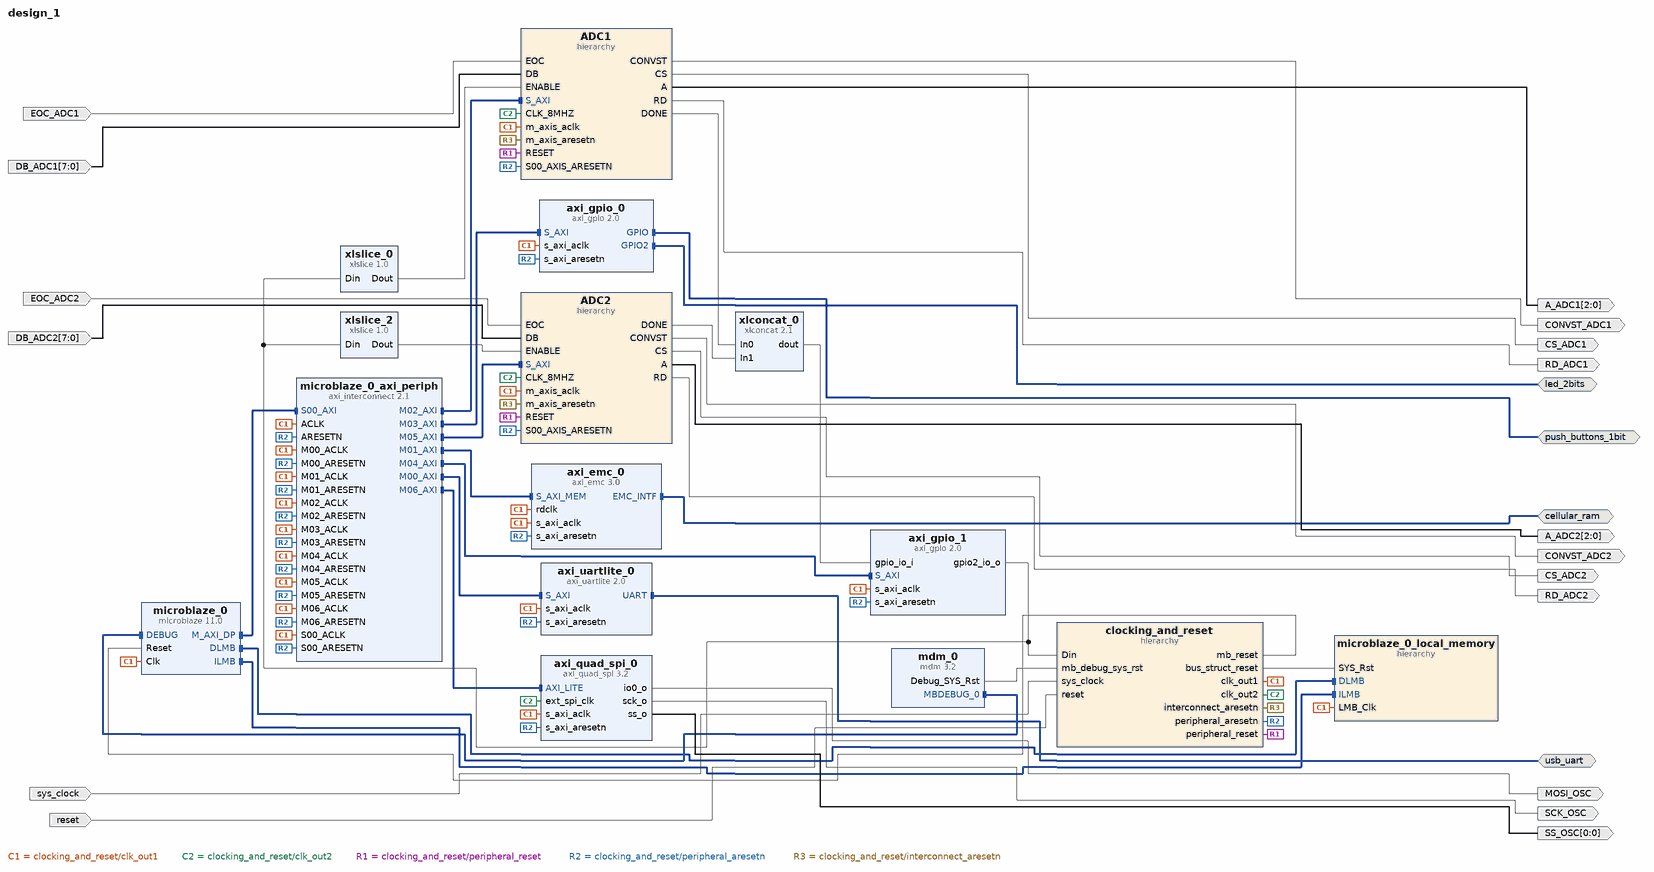
[diagram p0: block diagram of the top level]
# Vivado block design design_1, xc7a35tcpg236-1, Vivado 2018.3
create_bd_design design_1

create_bd_intf_port -mode Master -vlnv xilinx.com:interface:uart_rtl:1.0 usb_uart
create_bd_intf_port -mode Master -vlnv xilinx.com:interface:emc_rtl:1.0 cellular_ram
create_bd_intf_port -mode Master -vlnv xilinx.com:interface:gpio_rtl:1.0 led_2bits
create_bd_intf_port -mode Master -vlnv xilinx.com:interface:gpio_rtl:1.0 push_buttons_1bit
create_bd_port -dir I -type rst reset
set_property -dict {CONFIG.POLARITY ACTIVE_HIGH} [get_bd_ports reset]
create_bd_port -dir I -type clk sys_clock
set_property -dict {CONFIG.FREQ_HZ 12000000 CONFIG.PHASE 0.000} [get_bd_ports sys_clock]
create_bd_port -dir O RD_ADC1
create_bd_port -dir O CS_ADC1
create_bd_port -dir I EOC_ADC1
create_bd_port -dir I -from 7 -to 0 DB_ADC1
create_bd_port -dir O CONVST_ADC1
create_bd_port -dir O -from 2 -to 0 A_ADC1
create_bd_port -dir O CONVST_ADC2
create_bd_port -dir O CS_ADC2
create_bd_port -dir O -from 2 -to 0 A_ADC2
create_bd_port -dir O RD_ADC2
create_bd_port -dir I -from 7 -to 0 DB_ADC2
create_bd_port -dir I EOC_ADC2
create_bd_port -dir O MOSI_OSC
create_bd_port -dir O -from 0 -to 0 SS_OSC
create_bd_port -dir O SCK_OSC

create_bd_cell -type ip -vlnv xilinx.com:ip:mdm:3.2 mdm_0
create_bd_cell -type ip -vlnv xilinx.com:ip:microblaze:11.0 microblaze_0
set_property -dict {CONFIG.C_DEBUG_ENABLED 1 CONFIG.C_D_AXI 1 CONFIG.C_D_LMB 1 CONFIG.C_I_LMB 1} [get_bd_cells microblaze_0]
create_bd_cell -type hier microblaze_0_local_memory
create_bd_cell -type ip -vlnv xilinx.com:ip:axi_uartlite:2.0 axi_uartlite_0
set_property -dict [list \
  CONFIG.C_BAUDRATE 115200 \
  CONFIG.UARTLITE_BOARD_INTERFACE usb_uart \
  CONFIG.USE_BOARD_FLOW true \
] [get_bd_cells axi_uartlite_0]
create_bd_cell -type ip -vlnv xilinx.com:ip:axi_interconnect:2.1 microblaze_0_axi_periph
set_property -dict {CONFIG.NUM_MI 7} [get_bd_cells microblaze_0_axi_periph]
create_bd_cell -type ip -vlnv xilinx.com:ip:axi_emc:3.0 axi_emc_0
set_property -dict {CONFIG.EMC_BOARD_INTERFACE cellular_ram CONFIG.USE_BOARD_FLOW true} [get_bd_cells axi_emc_0]
create_bd_cell -type ip -vlnv xilinx.com:ip:axi_gpio:2.0 axi_gpio_0
set_property -dict [list \
  CONFIG.GPIO2_BOARD_INTERFACE led_2bits \
  CONFIG.GPIO_BOARD_INTERFACE push_buttons_1bit \
  CONFIG.USE_BOARD_FLOW true \
] [get_bd_cells axi_gpio_0]
create_bd_cell -type ip -vlnv xilinx.com:ip:axi_gpio:2.0 axi_gpio_1
set_property -dict [list \
  CONFIG.C_ALL_INPUTS 1 \
  CONFIG.C_ALL_OUTPUTS_2 1 \
  CONFIG.C_GPIO2_WIDTH 3 \
  CONFIG.C_GPIO_WIDTH 2 \
  CONFIG.C_IS_DUAL 1 \
  CONFIG.GPIO_BOARD_INTERFACE Custom \
  CONFIG.USE_BOARD_FLOW true \
] [get_bd_cells axi_gpio_1]
create_bd_cell -type ip -vlnv xilinx.com:ip:xlslice:1.0 xlslice_0
set_property -dict {CONFIG.DIN_FROM 1 CONFIG.DIN_TO 1 CONFIG.DIN_WIDTH 3 CONFIG.DOUT_WIDTH 1} [get_bd_cells xlslice_0]
create_bd_cell -type hier ADC1
create_bd_cell -type hier ADC2
create_bd_cell -type ip -vlnv xilinx.com:ip:xlslice:1.0 xlslice_2
set_property -dict {CONFIG.DIN_FROM 2 CONFIG.DIN_TO 2 CONFIG.DIN_WIDTH 3 CONFIG.DOUT_WIDTH 1} [get_bd_cells xlslice_2]
create_bd_cell -type ip -vlnv xilinx.com:ip:xlconcat:2.1 xlconcat_0
create_bd_cell -type hier clocking_and_reset
create_bd_cell -type ip -vlnv xilinx.com:ip:axi_quad_spi:3.2 axi_quad_spi_0
set_property -dict [list \
  CONFIG.C_FIFO_DEPTH 0 \
  CONFIG.C_NUM_TRANSFER_BITS 32 \
  CONFIG.C_SCK_RATIO 16 \
  CONFIG.C_USE_STARTUP 0 \
  CONFIG.FIFO_INCLUDED 0 \
  CONFIG.Master_mode 1 \
] [get_bd_cells axi_quad_spi_0]

# ---- hierarchy /microblaze_0_local_memory ----
current_bd_instance /microblaze_0_local_memory
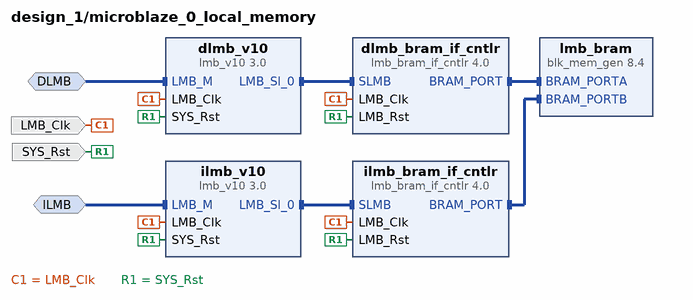
[diagram p1: block diagram inside /microblaze_0_local_memory]
create_bd_intf_pin -mode MirroredMaster -vlnv xilinx.com:interface:lmb_rtl:1.0 DLMB
create_bd_intf_pin -mode MirroredMaster -vlnv xilinx.com:interface:lmb_rtl:1.0 ILMB
create_bd_pin -dir I -type clk LMB_Clk
create_bd_pin -dir I -type rst SYS_Rst

create_bd_cell -type ip -vlnv xilinx.com:ip:lmb_v10:3.0 dlmb_v10
create_bd_cell -type ip -vlnv xilinx.com:ip:lmb_v10:3.0 ilmb_v10
create_bd_cell -type ip -vlnv xilinx.com:ip:lmb_bram_if_cntlr:4.0 dlmb_bram_if_cntlr
set_property -dict {CONFIG.C_ECC 0} [get_bd_cells dlmb_bram_if_cntlr]
create_bd_cell -type ip -vlnv xilinx.com:ip:lmb_bram_if_cntlr:4.0 ilmb_bram_if_cntlr
set_property -dict {CONFIG.C_ECC 0} [get_bd_cells ilmb_bram_if_cntlr]
create_bd_cell -type ip -vlnv xilinx.com:ip:blk_mem_gen:8.4 lmb_bram
set_property -dict {CONFIG.Memory_Type True_Dual_Port_RAM CONFIG.use_bram_block BRAM_Controller} [get_bd_cells lmb_bram]

# ---- hierarchy /ADC1 ----
current_bd_instance /ADC1
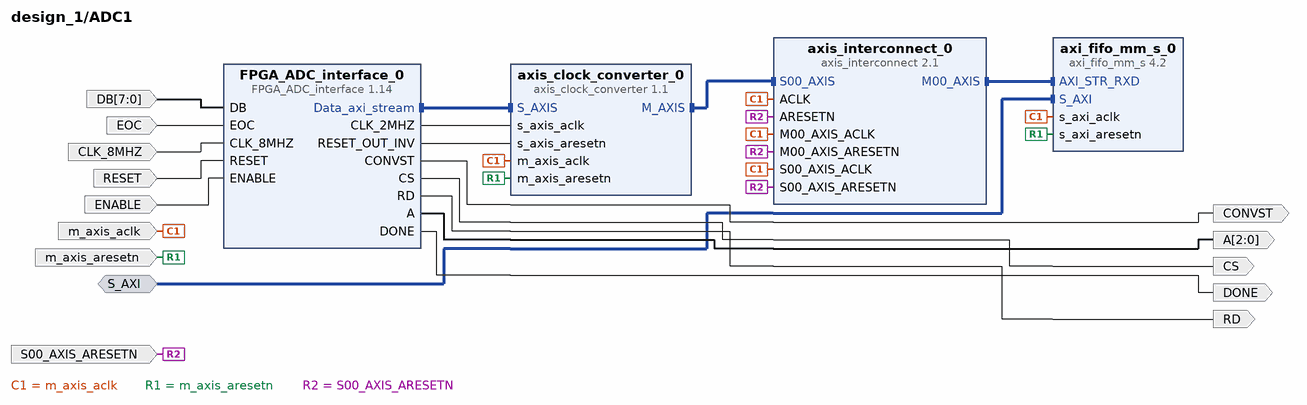
[diagram p2: block diagram inside /ADC1]
create_bd_intf_pin -mode Slave -vlnv xilinx.com:interface:aximm_rtl:1.0 S_AXI
create_bd_pin -dir O CONVST
create_bd_pin -dir I -from 7 -to 0 DB
create_bd_pin -dir I EOC
create_bd_pin -dir O CS
create_bd_pin -dir O RD
create_bd_pin -dir O -from 2 -to 0 A
create_bd_pin -dir O DONE
create_bd_pin -dir I -type clk CLK_8MHZ
create_bd_pin -dir I -type rst RESET
create_bd_pin -dir I ENABLE
create_bd_pin -dir I -type clk m_axis_aclk
create_bd_pin -dir I -type rst m_axis_aresetn
create_bd_pin -dir I -type rst S00_AXIS_ARESETN

create_bd_cell -type ip -vlnv Carslake.me:user:FPGA_ADC_interface:1.14 FPGA_ADC_interface_0
set_property -dict {CONFIG.MAXSAMPLES 32000} [get_bd_cells FPGA_ADC_interface_0]
create_bd_cell -type ip -vlnv xilinx.com:ip:axi_fifo_mm_s:4.2 axi_fifo_mm_s_0
set_property -dict [list \
  CONFIG.C_DATA_INTERFACE_TYPE 0 \
  CONFIG.C_RX_FIFO_DEPTH 8192 \
  CONFIG.C_RX_FIFO_PE_THRESHOLD 5 \
  CONFIG.C_RX_FIFO_PF_THRESHOLD 8100 \
  CONFIG.C_USE_TX_CTRL 0 \
  CONFIG.C_USE_TX_DATA 0 \
] [get_bd_cells axi_fifo_mm_s_0]
create_bd_cell -type ip -vlnv xilinx.com:ip:axis_clock_converter:1.1 axis_clock_converter_0
set_property -dict {CONFIG.SYNCHRONIZATION_STAGES 5} [get_bd_cells axis_clock_converter_0]
create_bd_cell -type ip -vlnv xilinx.com:ip:axis_interconnect:2.1 axis_interconnect_0
set_property -dict {CONFIG.ENABLE_ADVANCED_OPTIONS 1 CONFIG.NUM_MI 1} [get_bd_cells axis_interconnect_0]

# ---- hierarchy /ADC2 ----
current_bd_instance /ADC2
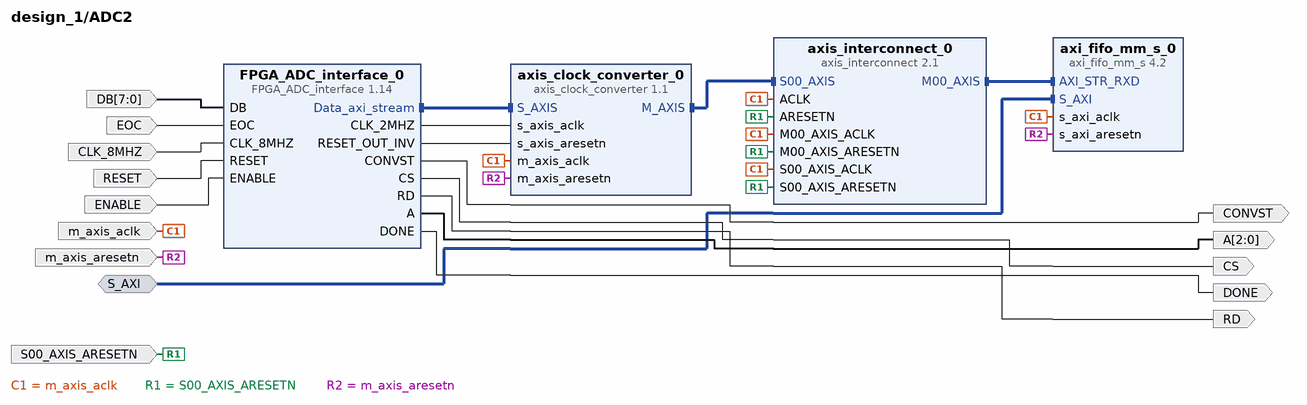
[diagram p3: block diagram inside /ADC2]
create_bd_intf_pin -mode Slave -vlnv xilinx.com:interface:aximm_rtl:1.0 S_AXI
create_bd_pin -dir O CONVST
create_bd_pin -dir I -from 7 -to 0 DB
create_bd_pin -dir I EOC
create_bd_pin -dir O CS
create_bd_pin -dir O RD
create_bd_pin -dir O -from 2 -to 0 A
create_bd_pin -dir O DONE
create_bd_pin -dir I -type clk CLK_8MHZ
create_bd_pin -dir I -type rst RESET
create_bd_pin -dir I ENABLE
create_bd_pin -dir I -type clk m_axis_aclk
create_bd_pin -dir I -type rst m_axis_aresetn
create_bd_pin -dir I -type rst S00_AXIS_ARESETN

create_bd_cell -type ip -vlnv Carslake.me:user:FPGA_ADC_interface:1.14 FPGA_ADC_interface_0
set_property -dict {CONFIG.MAXSAMPLES 32000} [get_bd_cells FPGA_ADC_interface_0]
create_bd_cell -type ip -vlnv xilinx.com:ip:axi_fifo_mm_s:4.2 axi_fifo_mm_s_0
set_property -dict [list \
  CONFIG.C_DATA_INTERFACE_TYPE 0 \
  CONFIG.C_RX_FIFO_DEPTH 8192 \
  CONFIG.C_RX_FIFO_PE_THRESHOLD 5 \
  CONFIG.C_RX_FIFO_PF_THRESHOLD 8100 \
  CONFIG.C_USE_TX_CTRL 0 \
  CONFIG.C_USE_TX_DATA 0 \
] [get_bd_cells axi_fifo_mm_s_0]
create_bd_cell -type ip -vlnv xilinx.com:ip:axis_clock_converter:1.1 axis_clock_converter_0
set_property -dict {CONFIG.SYNCHRONIZATION_STAGES 5} [get_bd_cells axis_clock_converter_0]
create_bd_cell -type ip -vlnv xilinx.com:ip:axis_interconnect:2.1 axis_interconnect_0
set_property -dict {CONFIG.ENABLE_ADVANCED_OPTIONS 1 CONFIG.NUM_MI 1} [get_bd_cells axis_interconnect_0]

# ---- hierarchy /clocking_and_reset ----
current_bd_instance /clocking_and_reset
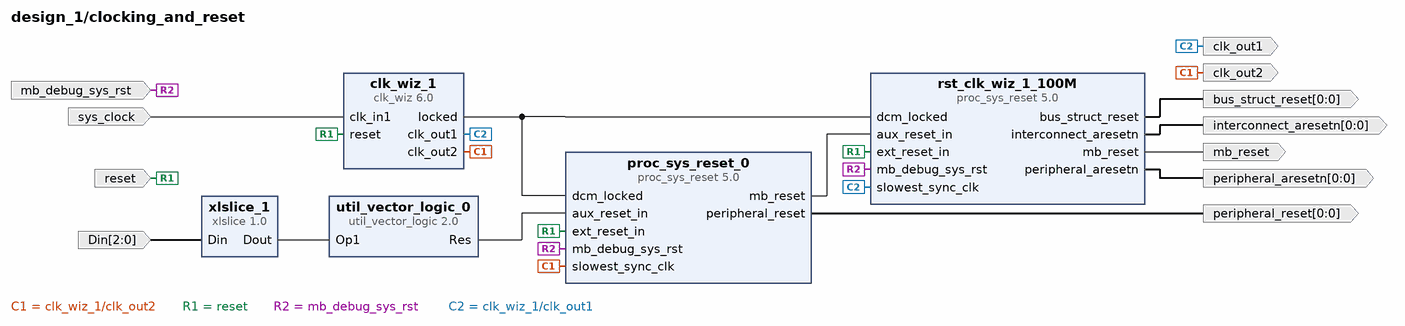
[diagram p4: block diagram inside /clocking_and_reset]
create_bd_pin -dir I -from 2 -to 0 Din
create_bd_pin -dir O -type clk clk_out2
create_bd_pin -dir I -type rst reset
create_bd_pin -dir I -type rst mb_debug_sys_rst
create_bd_pin -dir O -from 0 -to 0 -type rst peripheral_reset
create_bd_pin -dir O -type clk clk_out1
create_bd_pin -dir O -type rst mb_reset
create_bd_pin -dir O -from 0 -to 0 -type rst bus_struct_reset
create_bd_pin -dir O -from 0 -to 0 -type rst interconnect_aresetn
create_bd_pin -dir O -from 0 -to 0 -type rst peripheral_aresetn
create_bd_pin -dir I -type clk sys_clock

create_bd_cell -type ip -vlnv xilinx.com:ip:util_vector_logic:2.0 util_vector_logic_0
set_property -dict {CONFIG.C_OPERATION not CONFIG.C_SIZE 1} [get_bd_cells util_vector_logic_0]
create_bd_cell -type ip -vlnv xilinx.com:ip:xlslice:1.0 xlslice_1
set_property -dict {CONFIG.DIN_FROM 0 CONFIG.DIN_TO 0 CONFIG.DIN_WIDTH 3 CONFIG.DOUT_WIDTH 1} [get_bd_cells xlslice_1]
create_bd_cell -type ip -vlnv xilinx.com:ip:proc_sys_reset:5.0 proc_sys_reset_0
create_bd_cell -type ip -vlnv xilinx.com:ip:proc_sys_reset:5.0 rst_clk_wiz_1_100M
set_property -dict {CONFIG.RESET_BOARD_INTERFACE reset CONFIG.USE_BOARD_FLOW true} [get_bd_cells rst_clk_wiz_1_100M]
create_bd_cell -type ip -vlnv xilinx.com:ip:clk_wiz:6.0 clk_wiz_1
set_property -dict [list \
  CONFIG.CLKIN1_JITTER_PS 833.33 \
  CONFIG.CLKIN2_JITTER_PS 1000.0 \
  CONFIG.CLKOUT1_JITTER 571.161 \
  CONFIG.CLKOUT1_PHASE_ERROR 613.025 \
  CONFIG.CLKOUT2_JITTER 923.493 \
  CONFIG.CLKOUT2_PHASE_ERROR 613.025 \
  CONFIG.CLKOUT2_REQUESTED_OUT_FREQ 8.00 \
  CONFIG.CLKOUT2_USED true \
  CONFIG.CLK_IN1_BOARD_INTERFACE sys_clock \
  CONFIG.MMCM_CLKFBOUT_MULT_F 50.000 \
  CONFIG.MMCM_CLKIN1_PERIOD 83.333 \
  CONFIG.MMCM_CLKIN2_PERIOD 10.0 \
  CONFIG.MMCM_CLKOUT0_DIVIDE_F 6.000 \
  CONFIG.MMCM_CLKOUT1_DIVIDE 75 \
  CONFIG.MMCM_DIVCLK_DIVIDE 1 \
  CONFIG.NUM_OUT_CLKS 2 \
  CONFIG.PRIM_SOURCE Single_ended_clock_capable_pin \
  CONFIG.RESET_BOARD_INTERFACE reset \
  CONFIG.SECONDARY_IN_FREQ 100.000 \
  CONFIG.SECONDARY_SOURCE Single_ended_clock_capable_pin \
  CONFIG.USE_BOARD_FLOW true \
  CONFIG.USE_INCLK_SWITCHOVER false \
] [get_bd_cells clk_wiz_1]

# ---- connections ----

current_bd_instance /microblaze_0_local_memory
connect_bd_intf_net [get_bd_intf_pins dlmb_bram_if_cntlr/BRAM_PORT] [get_bd_intf_pins lmb_bram/BRAM_PORTA]
connect_bd_intf_net [get_bd_intf_pins ilmb_bram_if_cntlr/BRAM_PORT] [get_bd_intf_pins lmb_bram/BRAM_PORTB]
connect_bd_intf_net [get_bd_intf_pins ILMB] [get_bd_intf_pins ilmb_v10/LMB_M]
connect_bd_intf_net [get_bd_intf_pins dlmb_v10/LMB_Sl_0] [get_bd_intf_pins dlmb_bram_if_cntlr/SLMB]
connect_bd_intf_net [get_bd_intf_pins ilmb_v10/LMB_Sl_0] [get_bd_intf_pins ilmb_bram_if_cntlr/SLMB]
connect_bd_intf_net [get_bd_intf_pins DLMB] [get_bd_intf_pins dlmb_v10/LMB_M]
connect_bd_net -net microblaze_0_Clk [get_bd_pins LMB_Clk] \
  [get_bd_pins dlmb_v10/LMB_Clk] [get_bd_pins dlmb_bram_if_cntlr/LMB_Clk] [get_bd_pins ilmb_v10/LMB_Clk] \
  [get_bd_pins ilmb_bram_if_cntlr/LMB_Clk]
connect_bd_net [get_bd_pins SYS_Rst] \
  [get_bd_pins dlmb_v10/SYS_Rst] [get_bd_pins dlmb_bram_if_cntlr/LMB_Rst] [get_bd_pins ilmb_v10/SYS_Rst] \
  [get_bd_pins ilmb_bram_if_cntlr/LMB_Rst]
set_property HDL_ATTRIBUTE.BMM_INFO_ADDRESS_SPACE {byte  0x00000000 32 > design_1 microblaze_0_local_memory/lmb_bram} [get_bd_cells dlmb_bram_if_cntlr]
set_property HDL_ATTRIBUTE.KEEP_HIERARCHY yes [get_bd_cells dlmb_bram_if_cntlr]

current_bd_instance /ADC1
connect_bd_intf_net [get_bd_intf_pins S_AXI] [get_bd_intf_pins axi_fifo_mm_s_0/S_AXI]
connect_bd_intf_net [get_bd_intf_pins axis_interconnect_0/M00_AXIS] [get_bd_intf_pins axi_fifo_mm_s_0/AXI_STR_RXD]
connect_bd_intf_net [get_bd_intf_pins FPGA_ADC_interface_0/Data_axi_stream] [get_bd_intf_pins axis_clock_converter_0/S_AXIS]
connect_bd_intf_net [get_bd_intf_pins axis_clock_converter_0/M_AXIS] [get_bd_intf_pins axis_interconnect_0/S00_AXIS]
connect_bd_net [get_bd_pins FPGA_ADC_interface_0/CLK_2MHZ] [get_bd_pins axis_clock_converter_0/s_axis_aclk]
connect_bd_net -net FPGA_ADC_interface_0_RESET_OUT [get_bd_pins FPGA_ADC_interface_0/RESET_OUT_INV] \
  [get_bd_pins axis_clock_converter_0/s_axis_aresetn]
connect_bd_net [get_bd_pins FPGA_ADC_interface_0/CONVST] [get_bd_pins CONVST]
connect_bd_net [get_bd_pins DB] [get_bd_pins FPGA_ADC_interface_0/DB]
connect_bd_net [get_bd_pins EOC] [get_bd_pins FPGA_ADC_interface_0/EOC]
connect_bd_net [get_bd_pins FPGA_ADC_interface_0/CS] [get_bd_pins CS]
connect_bd_net [get_bd_pins FPGA_ADC_interface_0/RD] [get_bd_pins RD]
connect_bd_net [get_bd_pins FPGA_ADC_interface_0/A] [get_bd_pins A]
connect_bd_net [get_bd_pins FPGA_ADC_interface_0/DONE] [get_bd_pins DONE]
connect_bd_net -net clk_wiz_1_clk_out2 [get_bd_pins CLK_8MHZ] [get_bd_pins FPGA_ADC_interface_0/CLK_8MHZ]
connect_bd_net -net proc_sys_reset_0_peripheral_reset [get_bd_pins RESET] [get_bd_pins FPGA_ADC_interface_0/RESET]
connect_bd_net -net BTN1_1 [get_bd_pins ENABLE] [get_bd_pins FPGA_ADC_interface_0/ENABLE]
connect_bd_net -net clk_wiz_1_clk_out1 [get_bd_pins m_axis_aclk] \
  [get_bd_pins axis_clock_converter_0/m_axis_aclk] [get_bd_pins axis_interconnect_0/ACLK] \
  [get_bd_pins axis_interconnect_0/S00_AXIS_ACLK] [get_bd_pins axis_interconnect_0/M00_AXIS_ACLK] \
  [get_bd_pins axi_fifo_mm_s_0/s_axi_aclk]
connect_bd_net -net rst_clk_wiz_1_100M_interconnect_aresetn [get_bd_pins m_axis_aresetn] \
  [get_bd_pins axis_clock_converter_0/m_axis_aresetn] [get_bd_pins axi_fifo_mm_s_0/s_axi_aresetn]
connect_bd_net -net rst_clk_wiz_1_100M_peripheral_aresetn [get_bd_pins S00_AXIS_ARESETN] \
  [get_bd_pins axis_interconnect_0/S00_AXIS_ARESETN] [get_bd_pins axis_interconnect_0/M00_AXIS_ARESETN] \
  [get_bd_pins axis_interconnect_0/ARESETN]

current_bd_instance /ADC2
connect_bd_intf_net [get_bd_intf_pins S_AXI] [get_bd_intf_pins axi_fifo_mm_s_0/S_AXI]
connect_bd_intf_net [get_bd_intf_pins axis_clock_converter_0/M_AXIS] [get_bd_intf_pins axis_interconnect_0/S00_AXIS]
connect_bd_intf_net [get_bd_intf_pins axis_interconnect_0/M00_AXIS] [get_bd_intf_pins axi_fifo_mm_s_0/AXI_STR_RXD]
connect_bd_intf_net [get_bd_intf_pins FPGA_ADC_interface_0/Data_axi_stream] [get_bd_intf_pins axis_clock_converter_0/S_AXIS]
connect_bd_net [get_bd_pins FPGA_ADC_interface_0/CLK_2MHZ] [get_bd_pins axis_clock_converter_0/s_axis_aclk]
connect_bd_net -net FPGA_ADC_interface_0_RESET_OUT [get_bd_pins FPGA_ADC_interface_0/RESET_OUT_INV] \
  [get_bd_pins axis_clock_converter_0/s_axis_aresetn]
connect_bd_net [get_bd_pins FPGA_ADC_interface_0/CONVST] [get_bd_pins CONVST]
connect_bd_net [get_bd_pins DB] [get_bd_pins FPGA_ADC_interface_0/DB]
connect_bd_net [get_bd_pins EOC] [get_bd_pins FPGA_ADC_interface_0/EOC]
connect_bd_net [get_bd_pins FPGA_ADC_interface_0/CS] [get_bd_pins CS]
connect_bd_net [get_bd_pins FPGA_ADC_interface_0/RD] [get_bd_pins RD]
connect_bd_net [get_bd_pins FPGA_ADC_interface_0/A] [get_bd_pins A]
connect_bd_net [get_bd_pins FPGA_ADC_interface_0/DONE] [get_bd_pins DONE]
connect_bd_net -net clk_wiz_1_clk_out2 [get_bd_pins CLK_8MHZ] [get_bd_pins FPGA_ADC_interface_0/CLK_8MHZ]
connect_bd_net -net proc_sys_reset_0_peripheral_reset [get_bd_pins RESET] [get_bd_pins FPGA_ADC_interface_0/RESET]
connect_bd_net -net BTN1_1 [get_bd_pins ENABLE] [get_bd_pins FPGA_ADC_interface_0/ENABLE]
connect_bd_net -net clk_wiz_1_clk_out1 [get_bd_pins m_axis_aclk] \
  [get_bd_pins axis_clock_converter_0/m_axis_aclk] [get_bd_pins axis_interconnect_0/ACLK] \
  [get_bd_pins axis_interconnect_0/S00_AXIS_ACLK] [get_bd_pins axis_interconnect_0/M00_AXIS_ACLK] \
  [get_bd_pins axi_fifo_mm_s_0/s_axi_aclk]
connect_bd_net -net rst_clk_wiz_1_100M_peripheral_aresetn [get_bd_pins S00_AXIS_ARESETN] \
  [get_bd_pins axis_interconnect_0/S00_AXIS_ARESETN] [get_bd_pins axis_interconnect_0/M00_AXIS_ARESETN] \
  [get_bd_pins axis_interconnect_0/ARESETN]
connect_bd_net [get_bd_pins m_axis_aresetn] [get_bd_pins axis_clock_converter_0/m_axis_aresetn] [get_bd_pins axi_fifo_mm_s_0/s_axi_aresetn]

current_bd_instance /clocking_and_reset
connect_bd_net [get_bd_pins xlslice_1/Dout] [get_bd_pins util_vector_logic_0/Op1]
connect_bd_net [get_bd_pins util_vector_logic_0/Res] [get_bd_pins proc_sys_reset_0/aux_reset_in]
connect_bd_net [get_bd_pins clk_wiz_1/locked] [get_bd_pins rst_clk_wiz_1_100M/dcm_locked] [get_bd_pins proc_sys_reset_0/dcm_locked]
connect_bd_net [get_bd_pins proc_sys_reset_0/mb_reset] [get_bd_pins rst_clk_wiz_1_100M/aux_reset_in]
connect_bd_net -net axi_gpio_1_gpio2_io_o [get_bd_pins Din] [get_bd_pins xlslice_1/Din]
connect_bd_net [get_bd_pins clk_wiz_1/clk_out2] [get_bd_pins clk_out2] [get_bd_pins proc_sys_reset_0/slowest_sync_clk]
connect_bd_net [get_bd_pins reset] \
  [get_bd_pins rst_clk_wiz_1_100M/ext_reset_in] [get_bd_pins clk_wiz_1/reset] [get_bd_pins proc_sys_reset_0/ext_reset_in]
connect_bd_net -net mdm_1_debug_sys_rst [get_bd_pins mb_debug_sys_rst] \
  [get_bd_pins rst_clk_wiz_1_100M/mb_debug_sys_rst] [get_bd_pins proc_sys_reset_0/mb_debug_sys_rst]
connect_bd_net [get_bd_pins proc_sys_reset_0/peripheral_reset] [get_bd_pins peripheral_reset]
connect_bd_net [get_bd_pins clk_wiz_1/clk_out1] [get_bd_pins clk_out1] [get_bd_pins rst_clk_wiz_1_100M/slowest_sync_clk]
connect_bd_net [get_bd_pins rst_clk_wiz_1_100M/mb_reset] [get_bd_pins mb_reset]
connect_bd_net [get_bd_pins rst_clk_wiz_1_100M/bus_struct_reset] [get_bd_pins bus_struct_reset]
connect_bd_net [get_bd_pins rst_clk_wiz_1_100M/interconnect_aresetn] [get_bd_pins interconnect_aresetn]
connect_bd_net [get_bd_pins rst_clk_wiz_1_100M/peripheral_aresetn] [get_bd_pins peripheral_aresetn]
connect_bd_net [get_bd_pins sys_clock] [get_bd_pins clk_wiz_1/clk_in1]

current_bd_instance /
connect_bd_intf_net [get_bd_intf_ports cellular_ram] [get_bd_intf_pins axi_emc_0/EMC_INTF]
connect_bd_intf_net [get_bd_intf_pins microblaze_0_axi_periph/M00_AXI] [get_bd_intf_pins axi_uartlite_0/S_AXI]
connect_bd_intf_net [get_bd_intf_pins microblaze_0_axi_periph/M05_AXI] [get_bd_intf_pins ADC2/S_AXI]
connect_bd_intf_net [get_bd_intf_pins microblaze_0/DLMB] [get_bd_intf_pins microblaze_0_local_memory/DLMB]
connect_bd_intf_net [get_bd_intf_pins microblaze_0_axi_periph/M01_AXI] [get_bd_intf_pins axi_emc_0/S_AXI_MEM]
connect_bd_intf_net [get_bd_intf_pins microblaze_0/M_AXI_DP] [get_bd_intf_pins microblaze_0_axi_periph/S00_AXI]
connect_bd_intf_net [get_bd_intf_pins microblaze_0/ILMB] [get_bd_intf_pins microblaze_0_local_memory/ILMB]
connect_bd_intf_net [get_bd_intf_pins microblaze_0_axi_periph/M04_AXI] [get_bd_intf_pins axi_gpio_1/S_AXI]
connect_bd_intf_net [get_bd_intf_ports push_buttons_1bit] [get_bd_intf_pins axi_gpio_0/GPIO]
connect_bd_intf_net [get_bd_intf_pins mdm_0/MBDEBUG_0] [get_bd_intf_pins microblaze_0/DEBUG]
connect_bd_intf_net [get_bd_intf_ports led_2bits] [get_bd_intf_pins axi_gpio_0/GPIO2]
connect_bd_intf_net [get_bd_intf_ports usb_uart] [get_bd_intf_pins axi_uartlite_0/UART]
connect_bd_intf_net [get_bd_intf_pins microblaze_0_axi_periph/M02_AXI] [get_bd_intf_pins ADC1/S_AXI]
connect_bd_intf_net [get_bd_intf_pins microblaze_0_axi_periph/M03_AXI] [get_bd_intf_pins axi_gpio_0/S_AXI]
connect_bd_intf_net [get_bd_intf_pins microblaze_0_axi_periph/M06_AXI] [get_bd_intf_pins axi_quad_spi_0/AXI_LITE]
connect_bd_net -net rst_clk_wiz_1_100M_mb_reset [get_bd_pins clocking_and_reset/mb_reset] [get_bd_pins microblaze_0/Reset]
connect_bd_net -net rst_clk_wiz_1_100M_bus_struct_reset [get_bd_pins clocking_and_reset/bus_struct_reset] \
  [get_bd_pins microblaze_0_local_memory/SYS_Rst]
connect_bd_net -net mdm_1_debug_sys_rst [get_bd_pins mdm_0/Debug_SYS_Rst] [get_bd_pins clocking_and_reset/mb_debug_sys_rst]
connect_bd_net -net clk_wiz_1_clk_out1 [get_bd_pins clocking_and_reset/clk_out1] \
  [get_bd_pins microblaze_0/Clk] [get_bd_pins microblaze_0_local_memory/LMB_Clk] \
  [get_bd_pins microblaze_0_axi_periph/S00_ACLK] [get_bd_pins axi_uartlite_0/s_axi_aclk] \
  [get_bd_pins microblaze_0_axi_periph/M00_ACLK] [get_bd_pins microblaze_0_axi_periph/ACLK] \
  [get_bd_pins axi_emc_0/s_axi_aclk] [get_bd_pins microblaze_0_axi_periph/M01_ACLK] [get_bd_pins axi_emc_0/rdclk] \
  [get_bd_pins microblaze_0_axi_periph/M02_ACLK] [get_bd_pins microblaze_0_axi_periph/M03_ACLK] \
  [get_bd_pins axi_gpio_0/s_axi_aclk] [get_bd_pins axi_gpio_1/s_axi_aclk] [get_bd_pins microblaze_0_axi_periph/M04_ACLK] \
  [get_bd_pins ADC1/m_axis_aclk] [get_bd_pins ADC2/m_axis_aclk] [get_bd_pins microblaze_0_axi_periph/M05_ACLK] \
  [get_bd_pins axi_quad_spi_0/s_axi_aclk] [get_bd_pins microblaze_0_axi_periph/M06_ACLK]
connect_bd_net -net EOC_1 [get_bd_ports EOC_ADC1] [get_bd_pins ADC1/EOC]
connect_bd_net -net DB_1 [get_bd_ports DB_ADC1] [get_bd_pins ADC1/DB]
connect_bd_net -net FPGA_ADC_interface_0_CONVST [get_bd_pins ADC1/CONVST] [get_bd_ports CONVST_ADC1]
connect_bd_net -net FPGA_ADC_interface_0_CS [get_bd_pins ADC1/CS] [get_bd_ports CS_ADC1]
connect_bd_net -net FPGA_ADC_interface_0_RD [get_bd_pins ADC1/RD] [get_bd_ports RD_ADC1]
connect_bd_net -net BTN1_1 [get_bd_pins xlslice_0/Dout] [get_bd_pins ADC1/ENABLE]
connect_bd_net -net FPGA_ADC_interface_0_A [get_bd_pins ADC1/A] [get_bd_ports A_ADC1]
connect_bd_net [get_bd_ports sys_clock] [get_bd_pins clocking_and_reset/sys_clock]
connect_bd_net [get_bd_ports reset] [get_bd_pins clocking_and_reset/reset]
connect_bd_net -net clk_wiz_1_clk_out2 [get_bd_pins clocking_and_reset/clk_out2] \
  [get_bd_pins ADC1/CLK_8MHZ] [get_bd_pins ADC2/CLK_8MHZ] [get_bd_pins axi_quad_spi_0/ext_spi_clk]
connect_bd_net -net proc_sys_reset_0_peripheral_reset [get_bd_pins clocking_and_reset/peripheral_reset] \
  [get_bd_pins ADC1/RESET] [get_bd_pins ADC2/RESET]
connect_bd_net -net rst_clk_wiz_1_100M_peripheral_aresetn [get_bd_pins clocking_and_reset/peripheral_aresetn] \
  [get_bd_pins microblaze_0_axi_periph/S00_ARESETN] [get_bd_pins axi_uartlite_0/s_axi_aresetn] \
  [get_bd_pins microblaze_0_axi_periph/M00_ARESETN] [get_bd_pins microblaze_0_axi_periph/ARESETN] \
  [get_bd_pins axi_emc_0/s_axi_aresetn] [get_bd_pins microblaze_0_axi_periph/M01_ARESETN] \
  [get_bd_pins microblaze_0_axi_periph/M02_ARESETN] [get_bd_pins microblaze_0_axi_periph/M03_ARESETN] \
  [get_bd_pins axi_gpio_0/s_axi_aresetn] [get_bd_pins axi_gpio_1/s_axi_aresetn] \
  [get_bd_pins microblaze_0_axi_periph/M04_ARESETN] [get_bd_pins ADC1/S00_AXIS_ARESETN] \
  [get_bd_pins microblaze_0_axi_periph/M05_ARESETN] [get_bd_pins ADC2/S00_AXIS_ARESETN] \
  [get_bd_pins axi_quad_spi_0/s_axi_aresetn] [get_bd_pins microblaze_0_axi_periph/M06_ARESETN]
connect_bd_net -net rst_clk_wiz_1_100M_interconnect_aresetn [get_bd_pins clocking_and_reset/interconnect_aresetn] \
  [get_bd_pins ADC1/m_axis_aresetn] [get_bd_pins ADC2/m_axis_aresetn]
connect_bd_net [get_bd_pins axi_gpio_1/gpio2_io_o] [get_bd_pins xlslice_0/Din] [get_bd_pins xlslice_2/Din] [get_bd_pins clocking_and_reset/Din]
connect_bd_net [get_bd_pins xlslice_2/Dout] [get_bd_pins ADC2/ENABLE]
connect_bd_net [get_bd_pins xlconcat_0/dout] [get_bd_pins axi_gpio_1/gpio_io_i]
connect_bd_net [get_bd_pins ADC1/DONE] [get_bd_pins xlconcat_0/In0]
connect_bd_net [get_bd_pins ADC2/DONE] [get_bd_pins xlconcat_0/In1]
connect_bd_net [get_bd_pins ADC2/CONVST] [get_bd_ports CONVST_ADC2]
connect_bd_net [get_bd_pins ADC2/CS] [get_bd_ports CS_ADC2]
connect_bd_net [get_bd_pins ADC2/A] [get_bd_ports A_ADC2]
connect_bd_net [get_bd_pins ADC2/RD] [get_bd_ports RD_ADC2]
connect_bd_net -net EOC_ADC2_1 [get_bd_ports EOC_ADC2] [get_bd_pins ADC2/EOC]
connect_bd_net -net DB_ADC2_1 [get_bd_ports DB_ADC2] [get_bd_pins ADC2/DB]
connect_bd_net [get_bd_pins axi_quad_spi_0/io0_o] [get_bd_ports MOSI_OSC]
connect_bd_net [get_bd_pins axi_quad_spi_0/sck_o] [get_bd_ports SCK_OSC]
connect_bd_net [get_bd_pins axi_quad_spi_0/ss_o] [get_bd_ports SS_OSC]
set_property HDL_ATTRIBUTE.BMM_INFO_PROCESSOR {microblaze-le > design_1 microblaze_0_local_memory/dlmb_bram_if_cntlr} [get_bd_cells microblaze_0]
set_property HDL_ATTRIBUTE.KEEP_HIERARCHY yes [get_bd_cells microblaze_0]

# ---- address map ----
assign_bd_address -offset 0x00000000 -range 32K -target_address_space [get_bd_addr_spaces microblaze_0/Data] [get_bd_addr_segs microblaze_0_local_memory/dlmb_bram_if_cntlr/SLMB/Mem]
assign_bd_address -offset 0x40000000 -range 64K -target_address_space [get_bd_addr_spaces microblaze_0/Data] [get_bd_addr_segs axi_gpio_0/S_AXI/Reg]
assign_bd_address -offset 0x40010000 -range 64K -target_address_space [get_bd_addr_spaces microblaze_0/Data] [get_bd_addr_segs axi_gpio_1/S_AXI/Reg]
assign_bd_address -offset 0x40600000 -range 64K -target_address_space [get_bd_addr_spaces microblaze_0/Data] [get_bd_addr_segs axi_uartlite_0/S_AXI/Reg]
assign_bd_address -offset 0x44A00000 -range 64K -target_address_space [get_bd_addr_spaces microblaze_0/Data] [get_bd_addr_segs ADC1/axi_fifo_mm_s_0/S_AXI/Mem0]
assign_bd_address -offset 0x44A10000 -range 64K -target_address_space [get_bd_addr_spaces microblaze_0/Data] [get_bd_addr_segs ADC2/axi_fifo_mm_s_0/S_AXI/Mem0]
assign_bd_address -offset 0x44A20000 -range 64K -target_address_space [get_bd_addr_spaces microblaze_0/Data] [get_bd_addr_segs axi_quad_spi_0/AXI_LITE/Reg]
assign_bd_address -offset 0x60000000 -range 32M -target_address_space [get_bd_addr_spaces microblaze_0/Data] [get_bd_addr_segs axi_emc_0/S_AXI_MEM/Mem0]
assign_bd_address -offset 0x00000000 -range 32K -target_address_space [get_bd_addr_spaces microblaze_0/Instruction] [get_bd_addr_segs microblaze_0_local_memory/ilmb_bram_if_cntlr/SLMB/Mem]

validate_bd_design
save_bd_design
